# EAGLE schematic Sij2 (EAGLE 7.6.0)
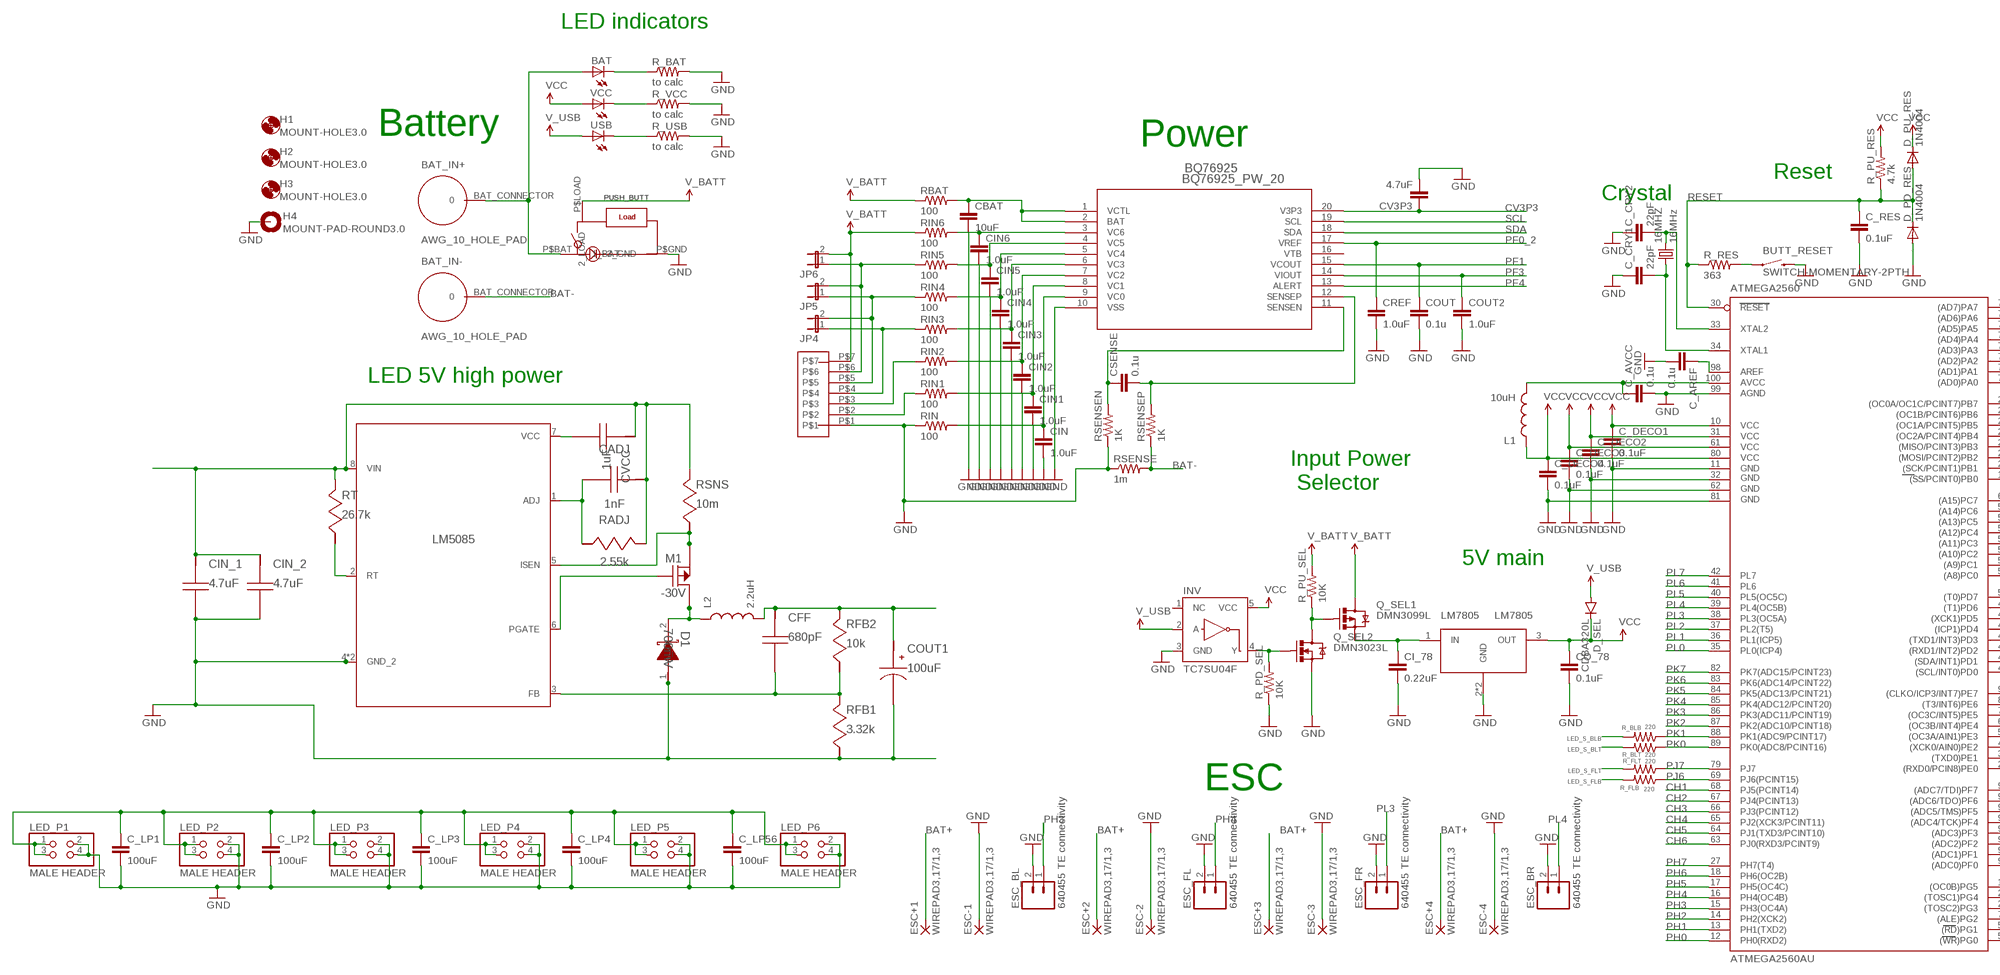
[diagram p0: schematic, sheet 1, part 1 of 2]
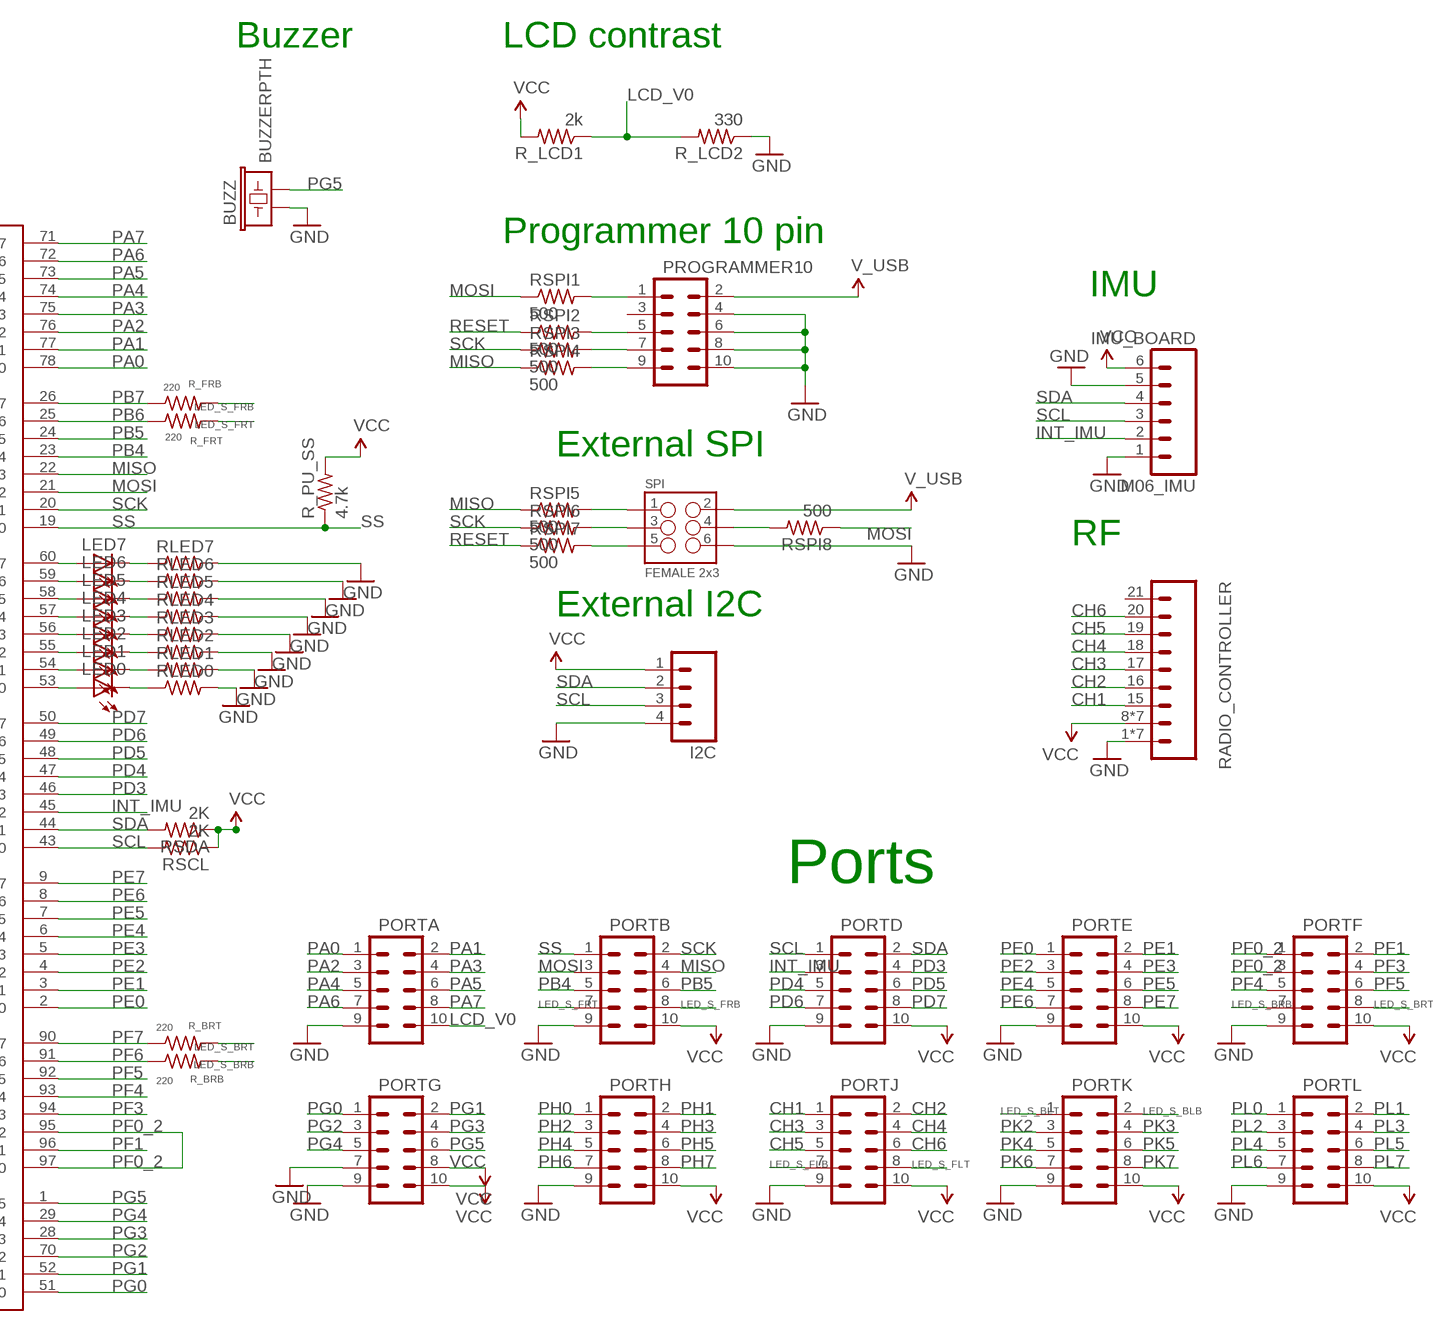
[diagram p1: schematic, sheet 1, part 2 of 2]

## Parts
16MHZ  16MHz  CRYSTALHC49US  [HC49US]
ATMEGA2560  ATMEGA2560AU  [TQFP100]
BAT  LEDCHIPLED_0805  [CHIPLED_0805]
BAT-MONIT  7_PIN_JST-XH  [7_PIN_JST-XH]
BAT_IN+  AWG_10_HOLE_PAD  [AWG10_HOLE_PAD]
BAT_IN-  AWG_10_HOLE_PAD  [AWG10_HOLE_PAD]
BQ76925  BQ76925_PW_20  [PW20]
BUTT_RESET  SWITCH-MOMENTARY-2PTH  [TACTILE-PTH]
BUZZ  BUZZERPTH  [BUZZER-12MM]
C_AREF  0.1u  CAP0603-CAP  [0603-CAP]
C_AVCC  0.1u  CAP0603-CAP  [0603-CAP]
C_CRY1  22pF  22PF-50V-5%(0603)  [0603-CAP]
C_CRY2  22pF  22PF-50V-5%(0603)  [0603-CAP]
C_DECO1  0.1uF  0.1UF-25V-5%(0603)  [0603-CAP]
C_DECO2  0.1uF  0.1UF-25V-5%(0603)  [0603-CAP]
C_DECO3  0.1uF  0.1UF-25V-5%(0603)  [0603-CAP]
C_DECO4  0.1uF  0.1UF-25V-5%(0603)  [0603-CAP]
C_LP1  100uF  CAP1206  [1206]
C_LP2  100uF  CAP1206  [1206]
C_LP3  100uF  CAP1206  [1206]
C_LP4  100uF  CAP1206  [1206]
C_LP56  100uF  CAP1206  [1206]
C_RES  0.1uF  0.1UF-25V-5%(0603)  [0603-CAP]
CADJ  1nF  GRM033R71C102KA01D  [0201]
CBAT  10uF  CAP0805  [0805]
CFF  680pF  GRM188R72E681KW07D  [0603]
CI_78  0.22uF  0.22UF-25V-10%(0603)  [0603-CAP]
CIN  1.0uF  1.0UF-16V-10%(0603)  [0603-CAP]
CIN1  1.0uF  1.0UF-16V-10%(0603)  [0603-CAP]
CIN2  1.0uF  1.0UF-16V-10%(0603)  [0603-CAP]
CIN3  1.0uF  1.0UF-16V-10%(0603)  [0603-CAP]
CIN4  1.0uF  1.0UF-16V-10%(0603)  [0603-CAP]
CIN5  1.0uF  1.0UF-16V-10%(0603)  [0603-CAP]
CIN6  1.0uF  1.0UF-16V-10%(0603)  [0603-CAP]
CIN_1  4.7uF  GRM21BR61E475MA12L  [0805]
CIN_2  4.7uF  GRM21BR61E475MA12L  [0805]
CO_78  0.1uF  0.1UF-25V-5%(0603)  [0603-CAP]
COUT  0.1u  CAP0603-CAP  [0603-CAP]
COUT1  100uF  6TPH100MAEA  [CAPSMT_6_A09]
COUT2  1.0uF  1.0UF-16V-10%(0603)  [0603-CAP]
CREF  1.0uF  1.0UF-16V-10%(0603)  [0603-CAP]
CSENSE  0.1u  CAP0603-CAP  [0603-CAP]
CV3P3  4.7uF  4.7UF-6.3V-10%(0603)0603  [0603-CAP]
CVCC  1uF  GRM188R61C105KA93D  [0603]
D1  700mV  MBRB745PBF  [DDPAK]
D_PD_RES  1N4004  [DO41-10]
D_PU_RES  1N4004  [DO41-10]
D_SEL  CDBA320L  DIODESMA-ALT  [SMA-DIODE_ALT]
ESC+1  WIREPAD3,17/1,3  [3,17/1,3]
ESC+2  WIREPAD3,17/1,3  [3,17/1,3]
ESC+3  WIREPAD3,17/1,3  [3,17/1,3]
ESC+4  WIREPAD3,17/1,3  [3,17/1,3]
ESC-1  WIREPAD3,17/1,3  [3,17/1,3]
ESC-2  WIREPAD3,17/1,3  [3,17/1,3]
ESC-3  WIREPAD3,17/1,3  [3,17/1,3]
ESC-4  WIREPAD3,17/1,3  [3,17/1,3]
ESC_BL  640455 TE connectivity  M02PTH  [1X02]
ESC_BR  640455 TE connectivity  M02PTH  [1X02]
ESC_FL  640455 TE connectivity  M02PTH  [1X02]
ESC_FR  640455 TE connectivity  M02PTH  [1X02]
H1  MOUNT-HOLE3.0  [3,0]
H2  MOUNT-HOLE3.0  [3,0]
H3  MOUNT-HOLE3.0  [3,0]
H4  MOUNT-PAD-ROUND3.0  [3,0-PAD]
I2C  M041X04_NO_SILK  [1X04_NO_SILK]
IMU_BOARD  M06_IMU  [1X06_LONGPADS]
INV  TC7SU04F  INVERTER_SOT23-5  [SOT23-5]
JP4  JUMPER-2PTH  [1X02]
JP5  JUMPER-2PTH  [1X02]
JP6  JUMPER-2PTH  [1X02]
L1  10uH  INDUCTOR0805  [0805]
L2  2.2uH  IND_MGV0605  [MGV0605]
LED0  LEDCHIPLED_0805  [CHIPLED_0805]
LED1  LEDCHIPLED_0805  [CHIPLED_0805]
LED2  LEDCHIPLED_0805  [CHIPLED_0805]
LED3  LEDCHIPLED_0805  [CHIPLED_0805]
LED4  LEDCHIPLED_0805  [CHIPLED_0805]
LED5  LEDCHIPLED_0805  [CHIPLED_0805]
LED6  LEDCHIPLED_0805  [CHIPLED_0805]
LED7  LEDCHIPLED_0805  [CHIPLED_0805]
LED_P1  MALE HEADER  PINHD-2X2  [2X02]
LED_P2  MALE HEADER  PINHD-2X2  [2X02]
LED_P3  MALE HEADER  PINHD-2X2  [2X02]
LED_P4  MALE HEADER  PINHD-2X2  [2X02]
LED_P5  MALE HEADER  PINHD-2X2  [2X02]
LED_P6  MALE HEADER  PINHD-2X2  [2X02]
LM5085  LM5085MY/NOPB  [MUY08A]
LM7805  LM7805  [KTT3]
M1  -30V  SI7149DP  [POWERPAK_SO-8]
PORTA  M05X2PTH  [AVR_ICSP]
PORTB  M05X2PTH  [AVR_ICSP]
PORTD  M05X2PTH  [AVR_ICSP]
PORTE  M05X2PTH  [AVR_ICSP]
PORTF  M05X2PTH  [AVR_ICSP]
PORTG  M05X2PTH  [AVR_ICSP]
PORTH  M05X2PTH  [AVR_ICSP]
PORTJ  M05X2PTH  [AVR_ICSP]
PORTK  M05X2PTH  [AVR_ICSP]
PORTL  M05X2PTH  [AVR_ICSP]
PROGRAMMER10  M05X2PTH  [AVR_ICSP]
PUSH_BUTT  PUSH_BUTTON  [PUSH_BUTTON]
Q_SEL1  DMN3099L  MOSFET-PCHANNEL  [SOT23-3]
Q_SEL2  DMN3023L  MOSFET-NCHANNELAO3404A  [SOT23-3]
R_BAT  to calc  R-US_R0603  [R0603]
R_BLB  220  R-US_R0603  [R0603]
R_BLT  220  R-US_R0603  [R0603]
R_BRB  220  R-US_R0603  [R0603]
R_BRT  220  R-US_R0603  [R0603]
R_FLB  220  R-US_R0603  [R0603]
R_FLT  220  R-US_R0603  [R0603]
R_FRB  220  R-US_R0603  [R0603]
R_FRT  220  R-US_R0603  [R0603]
R_LCD1  2k  R-US_R0603  [R0603]
R_LCD2  330  R-US_R0603  [R0603]
R_PD_SEL  10K  R-US_R0603  [R0603]
R_PU_RES  4.7k  R-US_R0603  [R0603]
R_PU_SEL  10K  R-US_R0603  [R0603]
R_PU_SS  4.7k  R-US_R0603  [R0603]
R_RES  363  R-US_R0603  [R0603]
R_USB  to calc  R-US_R0603  [R0603]
R_VCC  to calc  R-US_R0603  [R0603]
RADIO_CONTROLLER  RF_CONTROL_3X7_CON  [3X07]
RADJ  2.55k  CRCW04022K55FKED  [0603]
RBAT  100  R-US_R0603  [R0603]
RFB1  3.32k  CRCW04023K32FKED  [0603]
RFB2  10k  CRCW040210K0FKED  [0603]
RIN  100  R-US_R0603  [R0603]
RIN1  100  R-US_R0603  [R0603]
RIN2  100  R-US_R0603  [R0603]
RIN3  100  R-US_R0603  [R0603]
RIN4  100  R-US_R0603  [R0603]
RIN5  100  R-US_R0603  [R0603]
RIN6  100  R-US_R0603  [R0603]
RLED0  R-US_R0603  [R0603]
RLED1  R-US_R0603  [R0603]
RLED2  R-US_R0603  [R0603]
RLED3  R-US_R0603  [R0603]
RLED4  R-US_R0603  [R0603]
RLED5  R-US_R0603  [R0603]
RLED6  R-US_R0603  [R0603]
RLED7  R-US_R0603  [R0603]
RSCL  2K  R-US_R0603  [R0603]
RSDA  2K  R-US_R0603  [R0603]
RSENSE  1m  R-US_R1206  [R1206]
RSENSEN  1K  R-US_R0603  [R0603]
RSENSEP  1K  R-US_R0603  [R0603]
RSNS  10m  CSR1206FK10L0  [1206]
RSPI1  500  R-US_R0603  [R0603]
RSPI2  500  R-US_R0603  [R0603]
RSPI3  500  R-US_R0603  [R0603]
RSPI4  500  R-US_R0603  [R0603]
RSPI5  500  R-US_R0603  [R0603]
RSPI6  500  R-US_R0603  [R0603]
RSPI7  500  R-US_R0603  [R0603]
RSPI8  500  R-US_R0603  [R0603]
RT  26.7k  CRCW040226K7FKED  [0603]
SPI  FEMALE 2x3  M03X2FEMALE  [2X3]
USB  LEDCHIPLED_0805  [CHIPLED_0805]
VCC  LEDCHIPLED_0805  [CHIPLED_0805]

## Nets
9_5085: D1.2(K) L2.P$1 M1.5(DRAIN_2) M1.6(DRAIN_2) M1.7(DRAIN_2) M1.8(DRAIN_2) M1.9(DRAIN_2)
ADJ_1085: CADJ.2 LM5085.1(ADJ) RADJ.2
BAT+: BAT.A BAT_IN+.BAT_CONNECTOR ESC+1.1(P) ESC+2.1(P) ESC+3.1(P) ESC+4.1(P) PUSH_BUTT.P$BAT(1_BAT)
BAT-: BAT_IN-.BAT_CONNECTOR RSENSE.2 RSENSEP.1
CH1: ATMEGA2560.68(PJ5(PCINT14)) PORTJ.1 RADIO_CONTROLLER.15
CH2: ATMEGA2560.67(PJ4(PCINT13)) PORTJ.2 RADIO_CONTROLLER.16
CH3: ATMEGA2560.66(PJ3(PCINT12)) PORTJ.3 RADIO_CONTROLLER.17
CH4: ATMEGA2560.65(PJ2(XCK3/PCINT11)) PORTJ.4 RADIO_CONTROLLER.18
CH5: ATMEGA2560.64(PJ1(TXD3/PCINT10)) PORTJ.5 RADIO_CONTROLLER.19
CH6: ATMEGA2560.63(PJ0(RXD3/PCINT9)) PORTJ.6 RADIO_CONTROLLER.20
CV3P3: BQ76925.20(V3P3) CV3P3.1
FB_5085: CFF.2 LM5085.3(FB) RFB1.1 RFB2.2
GND: ATMEGA2560.11(GND) ATMEGA2560.32(GND1) ATMEGA2560.62(GND2) ATMEGA2560.81(GND3) ATMEGA2560.99(AGND) BAT-MONIT.P$1 BQ76925.10(VSS) BUTT_RESET.3 BUTT_RESET.4 BUZZ.+ C_AREF.2 C_AVCC.2 C_CRY1.1 C_CRY2.1 C_DECO1.2 C_DECO2.2 C_DECO3.2 C_DECO4.2 C_LP1.2 C_LP2.2 C_LP3.2 C_LP4.2 C_LP56.2 C_RES.2 CBAT.2 CI_78.2 CIN1.2 CIN2.2 CIN3.2 CIN4.2 CIN5.2 CIN6.2 CIN.2 CIN_1.2 CIN_2.2 CO_78.2 COUT1.2(-) COUT2.2 COUT.2 CREF.2 CV3P3.2 D1.1(A_2) D_PD_RES.A ESC-1.1(P) ESC-2.1(P) ESC-3.1(P) ESC-4.1(P) ESC_BL.2 ESC_BR.2 ESC_FL.2 ESC_FR.2 H4.B3,0(MOUNT) I2C.4 IMU_BOARD.1 IMU_BOARD.5 INV.3(GND) LED_P1.2 LED_P1.4 LED_P2.2 LED_P2.4 LED_P3.2 LED_P3.4 LED_P4.2 LED_P4.4 LED_P5.2 LED_P5.4 LED_P6.2 LED_P6.4 LM5085.4(GND_2) LM5085.9(GND_2) LM7805.2(GND) LM7805.4(GND) PORTA.9 PORTB.9 PORTD.9 PORTE.9 PORTF.9 PORTG.7 PORTG.9 PORTH.9 PORTJ.9 PORTK.9 PORTL.9 PROGRAMMER10.4 PROGRAMMER10.6 PROGRAMMER10.8 PROGRAMMER10.10 PUSH_BUTT.P$GND(3_GND) Q_SEL2.2(S) R_BAT.2 R_LCD2.1 R_PD_SEL.1 R_USB.2 R_VCC.2 RADIO_CONTROLLER.1(GND) RADIO_CONTROLLER.2(GND) RADIO_CONTROLLER.3(GND) RADIO_CONTROLLER.4(GND) RADIO_CONTROLLER.5(GND) RADIO_CONTROLLER.6(GND) RADIO_CONTROLLER.7(GND) RFB1.2 RIN.1 RLED0.2 RLED1.2 RLED2.2 RLED3.2 RLED4.2 RLED5.2 RLED6.2 RLED7.2 RSENSE.1 RSENSEN.1 SPI.6
INT_IMU: ATMEGA2560.45((RXD1/INT2)PD2) IMU_BOARD.2 PORTD.3
ISEN_5085: LM5085.5(ISEN) M1.1(SOURCE_2) M1.2(SOURCE_2) M1.3(SOURCE_2) RSNS.2
LCD_V0: PORTA.10 R_LCD1.1 R_LCD2.2
LED_S_BLB: PORTK.2 R_BLB.2
LED_S_BLT: PORTK.1 R_BLT.2
LED_S_BRB: PORTF.7 R_BRB.2
LED_S_BRT: PORTF.8 R_BRT.2
LED_S_FLB: PORTJ.7 R_FLB.2
LED_S_FLT: PORTJ.8 R_FLT.2
LED_S_FRB: PORTB.8 R_FRB.2
LED_S_FRT: PORTB.7 R_FRT.2
MISO: ATMEGA2560.22((MISO/PCINT3)PB3) PORTB.4 RSPI4.1 RSPI5.1
MOSI: ATMEGA2560.21((MOSI/PCINT2)PB2) PORTB.3 RSPI1.1 RSPI8.1
N$1: PROGRAMMER10.7 RSPI3.2
N$2: PROGRAMMER10.1 RSPI1.2
N$3: PROGRAMMER10.9 RSPI4.2
N$4: CI_78.1 LM7805.1(IN) Q_SEL1.2(S)
N$5: ATMEGA2560.100(AVCC) C_AVCC.1 L1.2
N$6: 16MHZ.1 ATMEGA2560.34(XTAL1) C_CRY1.2
N$7: BQ76925.6(VC3) CIN3.1 RIN3.2
N$8: BQ76925.1(VCTL) BQ76925.2(BAT) CBAT.1 RBAT.2
N$9: BQ76925.7(VC2) CIN2.1 RIN2.2
N$10: BQ76925.8(VC1) CIN1.1 RIN1.2
N$11: BQ76925.9(VC0) CIN.1 RIN.2
N$12: BQ76925.5(VC4) CIN4.1 RIN4.2
N$13: INV.4(Y) Q_SEL2.1(G) R_PD_SEL.2
N$14: ATMEGA2560.60((A15)PC7) LED7.A
N$15: BQ76925.11(SENSEN) CSENSE.1 RSENSEN.2
N$16: BQ76925.12(SENSEP) CSENSE.2 RSENSEP.2
N$17: BQ76925.3(VC6) CIN6.1 RIN6.2
N$18: BQ76925.4(VC5) CIN5.1 RIN5.2
N$19: ATMEGA2560.59((A14)PC6) LED6.A
N$20: ATMEGA2560.58((A13)PC5) LED5.A
N$21: ATMEGA2560.57((A12)PC4) LED4.A
N$22: ATMEGA2560.56((A11)PC3) LED3.A
N$23: BAT-MONIT.P$2 RIN1.1
N$24: RSPI8.2 SPI.4
N$25: ATMEGA2560.55((A10)PC2) LED2.A
N$26: ATMEGA2560.54((A9)PC1) LED1.A
N$27: BAT-MONIT.P$3 RIN2.1
N$28: BAT-MONIT.P$4 JP4.1 RIN3.1
N$29: BAT-MONIT.P$5 JP4.2 JP5.1 RIN4.1
N$30: BAT-MONIT.P$6 JP5.2 JP6.1 RIN5.1
N$31: ATMEGA2560.53((A8)PC0) LED0.A
N$34: BUTT_RESET.1 BUTT_RESET.2 R_RES.2
N$35: R_USB.1 USB.C
N$36: 16MHZ.2 ATMEGA2560.33(XTAL2) C_CRY2.2
N$37: Q_SEL1.1(G) Q_SEL2.3(D) R_PU_SEL.1
N$38: R_VCC.1 VCC.C
N$39: LED7.C RLED7.1
N$40: LED6.C RLED6.1
N$41: LED5.C RLED5.1
N$42: RSPI6.2 SPI.3
N$43: LED4.C RLED4.1
N$44: LED3.C RLED3.1
N$45: LED2.C RLED2.1
N$46: LED1.C RLED1.1
N$47: LED0.C RLED0.1
N$48: BAT.C R_BAT.1
N$55: RSPI5.2 SPI.1
N$61: PROGRAMMER10.5 RSPI2.2
N$62: ATMEGA2560.98(AREF) C_AREF.1
N$64: RSPI7.2 SPI.5
PA0: ATMEGA2560.78((AD0)PA0) PORTA.1
PA1: ATMEGA2560.77((AD1)PA1) PORTA.2
PA2: ATMEGA2560.76((AD2)PA2) PORTA.3
PA3: ATMEGA2560.75((AD3)PA3) PORTA.4
PA4: ATMEGA2560.74((AD4)PA4) PORTA.5
PA5: ATMEGA2560.73((AD5)PA5) PORTA.6
PA6: ATMEGA2560.72((AD6)PA6) PORTA.7
PA7: ATMEGA2560.71((AD7)PA7) PORTA.8
PB4: ATMEGA2560.23((OC2A/PCINT4)PB4) PORTB.5
PB5: ATMEGA2560.24((OC1A/PCINT5)PB5) PORTB.6
PB6: ATMEGA2560.25((OC1B/PCINT6)PB6) R_FRT.1
PB7: ATMEGA2560.26((OC0A/OC1C/PCINT7)PB7) R_FRB.1
PD3: ATMEGA2560.46((TXD1/INT3)PD3) PORTD.4
PD4: ATMEGA2560.47((ICP1)PD4) PORTD.5
PD5: ATMEGA2560.48((XCK1)PD5) PORTD.6
PD6: ATMEGA2560.49((T1)PD6) PORTD.7
PD7: ATMEGA2560.50((T0)PD7) PORTD.8
PE0: ATMEGA2560.2((RXD0/PCIN8)PE0) PORTE.1
PE1: ATMEGA2560.3((TXD0)PE1) PORTE.2
PE2: ATMEGA2560.4((XCK0/AIN0)PE2) PORTE.3
PE3: ATMEGA2560.5((OC3A/AIN1)PE3) PORTE.4
PE4: ATMEGA2560.6((OC3B/INT4)PE4) PORTE.5
PE5: ATMEGA2560.7((OC3C/INT5)PE5) PORTE.6
PE6: ATMEGA2560.8((T3/INT6)PE6) PORTE.7
PE7: ATMEGA2560.9((CLKO/ICP3/INT7)PE7) PORTE.8
PF0_2: ATMEGA2560.95((ADC2)PF2) ATMEGA2560.97((ADC0)PF0) BQ76925.17(VREF) CREF.1 PORTF.1 PORTF.3
PF1: ATMEGA2560.96((ADC1)PF1) BQ76925.15(VCOUT) COUT.1 PORTF.2
PF3: ATMEGA2560.94((ADC3)PF3) BQ76925.14(VIOUT) COUT2.1 PORTF.4
PF4: ATMEGA2560.93((ADC4/TCK)PF4) BQ76925.13(ALERT) PORTF.5
PF5: ATMEGA2560.92((ADC5/TMS)PF5) PORTF.6
PF6: ATMEGA2560.91((ADC6/TDO)PF6) R_BRB.1
PF7: ATMEGA2560.90((ADC7/TDI)PF7) R_BRT.1
PG0: ATMEGA2560.51((WR)PG0) PORTG.1
PG1: ATMEGA2560.52((RD)PG1) PORTG.2
PG2: ATMEGA2560.70((ALE)PG2) PORTG.3
PG3: ATMEGA2560.28((TOSC2)PG3) PORTG.4
PG4: ATMEGA2560.29((TOSC1)PG4) PORTG.5
PG5: ATMEGA2560.1((OC0B)PG5) BUZZ.- PORTG.6
PGATE_5085: LM5085.6(PGATE) M1.4(GATE)
PH0: ATMEGA2560.12(PH0(RXD2)) PORTH.1
PH1: ATMEGA2560.13(PH1(TXD2)) PORTH.2
PH2: ATMEGA2560.14(PH2(XCK2)) PORTH.3
PH3: ATMEGA2560.15(PH3(OC4A)) ESC_BL.1 PORTH.4
PH4: ATMEGA2560.16(PH4(OC4B)) ESC_FL.1 PORTH.5
PH5: ATMEGA2560.17(PH5(OC4C)) PORTH.6
PH6: ATMEGA2560.18(PH6(OC2B)) PORTH.7
PH7: ATMEGA2560.27(PH7(T4)) PORTH.8
PJ6: ATMEGA2560.69(PJ6(PCINT15)) R_FLB.1
PJ7: ATMEGA2560.79(PJ7) R_FLT.1
PK0: ATMEGA2560.89(PK0(ADC8/PCINT16)) R_BLT.1
PK1: ATMEGA2560.88(PK1(ADC9/PCINT17)) R_BLB.1
PK2: ATMEGA2560.87(PK2(ADC10/PCINT18)) PORTK.3
PK3: ATMEGA2560.86(PK3(ADC11/PCINT19)) PORTK.4
PK4: ATMEGA2560.85(PK4(ADC12/PCINT20)) PORTK.5
PK5: ATMEGA2560.84(PK5(ADC13/PCINT21)) PORTK.6
PK6: ATMEGA2560.83(PK6(ADC14/PCINT22)) PORTK.7
PK7: ATMEGA2560.82(PK7(ADC15/PCINT23)) PORTK.8
PL0: ATMEGA2560.35(PL0(ICP4)) PORTL.1
PL1: ATMEGA2560.36(PL1(ICP5)) PORTL.2
PL2: ATMEGA2560.37(PL2(T5)) PORTL.3
PL3: ATMEGA2560.38(PL3(OC5A)) ESC_FR.1 PORTL.4
PL4: ATMEGA2560.39(PL4(OC5B)) ESC_BR.1 PORTL.5
PL5: ATMEGA2560.40(PL5(OC5C)) PORTL.6
PL6: ATMEGA2560.41(PL6) PORTL.7
PL7: ATMEGA2560.42(PL7) PORTL.8
RESET: ATMEGA2560.30(RESET) C_RES.1 D_PD_RES.C D_PU_RES.A R_PU_RES.1 R_RES.1 RSPI2.1 RSPI7.1
RT_5085: LM5085.2(RT) RT.2
SCK: ATMEGA2560.20((SCK/PCINT1)PB1) PORTB.2 RSPI3.1 RSPI6.1
SCL: ATMEGA2560.43((SCL/INT0)PD0) BQ76925.19(SCL) I2C.3 IMU_BOARD.3 PORTD.1 RSCL.2
SDA: ATMEGA2560.44((SDA/INT1)PD1) BQ76925.18(SDA) I2C.2 IMU_BOARD.4 PORTD.2 RSDA.2
SS: ATMEGA2560.19((SS/PCINT0)PB0) PORTB.1 R_PU_SS.1
V_BATT: BAT-MONIT.P$7 CADJ.1 CIN_1.1 CIN_2.1 CVCC.1 JP6.2 LM5085.8(VIN) PUSH_BUTT.P$LOAD(2_LOAD) Q_SEL1.3(D) R_PU_SEL.2 RADJ.1 RBAT.1 RIN6.1 RSNS.1 RT.1
V_USB: D_SEL.A INV.2(A) PROGRAMMER10.2 SPI.2 USB.A
VCC: ATMEGA2560.10(VCC) ATMEGA2560.31(VCC1) ATMEGA2560.61(VCC2) ATMEGA2560.80(VCC3) C_DECO1.1 C_DECO2.1 C_DECO3.1 C_DECO4.1 CO_78.1 D_PU_RES.C D_SEL.C I2C.1 IMU_BOARD.6 INV.5(VCC) L1.1 LM7805.3(OUT) PORTB.10 PORTD.10 PORTE.10 PORTF.10 PORTG.8 PORTG.10 PORTH.10 PORTJ.10 PORTK.10 PORTL.10 R_LCD1.2 R_PU_RES.2 R_PU_SS.2 RADIO_CONTROLLER.8(5V) RADIO_CONTROLLER.9(5V) RADIO_CONTROLLER.10(5V) RADIO_CONTROLLER.11(5V) RADIO_CONTROLLER.12(5V) RADIO_CONTROLLER.13(5V) RADIO_CONTROLLER.14(5V) RSCL.1 RSDA.1 VCC.A
VCC_1085: CVCC.2 LM5085.7(VCC)
VOUT_5085: C_LP1.1 C_LP2.1 C_LP3.1 C_LP4.1 C_LP56.1 CFF.1 COUT1.1(+) L2.P$2 LED_P1.1 LED_P1.3 LED_P2.1 LED_P2.3 LED_P3.1 LED_P3.3 LED_P4.1 LED_P4.3 LED_P5.1 LED_P5.3 LED_P6.1 LED_P6.3 RFB2.1
Unconnected: BQ76925.16(VTB) INV.1(NC) PROGRAMMER10.3 RADIO_CONTROLLER.21

## Notes on the sheet
- LED indicators
- Battery | Power
- Reset
- Buzzer | LCD contrast
- Crystal
- Programmer 10 pin
- IMU
- LED 5V high power
- External SPI
- Input Power
   Selector
- RF
- External I2C
- 5V main
- Ports
- ESC

## Library data of the parts
16MHZ = SparkFun-FreqCtrl:CRYSTAL: Various standard crystals. Proven footprints.; DATASHEET: https://cdn-shop.adafruit.com/product-files/2215/2215datasheet.pdf
ATMEGA2560 = SparkFun-DigitalIC:ATMEGA2560: Atmel 100-pin 8-bit uC 64/128/256 Kbytes FLASH 4 Kbytes EEPROM 8 Kbytes SRAM 86 General Purpose I/O pins 12-channels16-bit PWM 4 x Serial USARTs 16-channels 10-bit A/D; PROD_ID: IC-10040
BAT LED0 LED1-LED7 USB VCC = led:LED: LED OSRAM: - CHIPLED LG R971, LG N971, LY N971, LG Q971, LY Q971, LO R971, LY R971 LH N974, LH R974 LS Q976, LO Q976, LY Q976 LO Q996 - Hyper CHIPLED LW Q18S LB Q993, LB Q99A, LB R99A - SideLED LS A670, LO A670, LY A670, LG A670, LP A670 LB A673, LV A673, LT A673, LW A673 LH A674 LY A675 LS A676, LA A676, LO A676, LY A676, LW A676 LS A679, LY A679, LG A679 - Hyper Micro SIDELED® LS Y876, LA Y876, LO Y876, LY Y876 LT Y87S - SmartLED LW L88C, LW L88S LB L89C, LB L89S, LG L890 LS L89K, LO L89K, LY L89K LS L896, LA L896, LO L896, LY L896 - TOPLED LS T670, LO T670, LY T670, LG T670, LP T670 LSG T670, LSP T670, LSY T670, LOP T670, LYG T670 LG T671, LOG T671, LSG T671 LB T673, LV T673, LT T673, LW T673 LH T674 LS T676, LA T676, LO T676, LY T676, LB T676, LH T676, LSB T676, LW T676 LB T67C, LV T67C, LT T67C, LS T67K, LO T67K, LY T67K, LW E67C LS E67B, LA E67B, LO E67B, LY E67B, LB E67C, LV E67C, LT E67C LW T67C LS T679, LY T679, LG T679 LS T770, LO T770, LY T770, LG T770, LP T770 LB T773, LV T773, LT T773, LW T773 LH T774 LS E675, LA E675, LY E675, LS T675 LS T776, LA T776, LO T776, LY T776, LB T776 LHGB T686 LT T68C, LB T68C - Hyper Mini TOPLED® LB M676 - Mini TOPLED Santana® LG M470 LS M47K, LO M47K, LY M47K Source: http://www.osram.convergy.de LUXEON: - LUMILED® LXK2-PW12-R00, LXK2-PW12-S00, LXK2-PW14-U00, LXK2-PW14-V00 LXK2-PM12-R00, LXK2-PM12-S00, LXK2-PM14-U00 LXK2-PE12-Q00, LXK2-PE12-R00, LXK2-PE12-S00, LXK2-PE14-T00, LXK2-PE14-U00 LXK2-PB12-K00, LXK2-PB12-L00, LXK2-PB12-M00, LXK2-PB14-N00, LXK2-PB14-P00, LXK2-PB14-Q00 LXK2-PR12-L00, LXK2-PR12-M00, LXK2-PR14-Q00, LXK2-PR14-R00 LXK2-PD12-Q00, LXK2-PD12-R00, LXK2-PD12-S00 LXK2-PH12-R00, LXK2-PH12-S00 LXK2-PL12-P00, LXK2-PL12-Q00, LXK2-PL12-R00 Source: www.luxeon.com KINGBRIGHT: KA-3528ASYC Source: www.kingbright.com
BAT-MONIT = JST-XH_HEADERS:7_PIN_JST-XH
BAT_IN+ BAT_IN- = custom_parts:AWG_10_HOLE_PAD; AWG_RATING: 12
BQ76925 = TI:BQ76925_PW_20; DATASHEETURL: http://www.ti.com/lit/gpn/BQ76925; DESCRIPTION: Analog Front End for 3 to 6 Series Lithium-Ion Cells; FAMILY_NAME: LITHIUM ION PROTECTION; GENERIC_PART_NUMBER: BQ76925; INDUSTRY_STD_PKG_TYPE: TSSOP; MANUFACTURER: Texas Instruments; MANUFACTURER_PART_NUMBER: bq76925_pw_20; PACKAGE_DESIGNATOR: PW; PIN_COUNT: 20; VENDOR: Texas Instruments
BUTT_RESET = SparkFun-Electromechanical:SWITCH-MOMENTARY-2: Various NO switches- pushbuttons, reed, etc; PROD_ID: SWCH-08441
BUZZ = SparkFun-Electromechanical:BUZZER: Buzzer 12mm Spark Fun Electronics SKU : Comp-Buzzer
C_AREF C_AVCC CBAT COUT = SparkFun-Capacitors:CAP: Capacitor Standard 0603 ceramic capacitor, and 0.1" leaded capacitor.
C_CRY1 C_CRY2 = SparkFun-Capacitors:22PF-50V-5%(0603): CAP-07876; PROD_ID: CAP-07876
C_DECO1-C_DECO4 C_RES CO_78 = SparkFun-Capacitors:0.1UF-25V-5%(0603): CAP-08604; PROD_ID: CAP-08604
C_LP1-C_LP4 C_LP56 = SparkFun-Capacitors:CAP: Capacitor Standard 0603 ceramic capacitor, and 0.1" leaded capacitor.; DATASHEET: http://www.digikey.ca/product-detail/en/murata-electronics-north-america/GRM31CD80J107ME39L/490-10525-1-ND/5026461
CADJ = LM5085:GRM033R71C102KA01D; CAP: 1.0E-9; ESR: 0.0; IRMS: 0.0; MANUFACTURER_NAME: MuRata; MANUFACTURER_PART_NUMBER: GRM033R71C102KA01D; VDC: 16.0; VENDOR: MuRata
CFF = LM5085:GRM188R72E681KW07D; CAP: 6.8E-10; ESR: 0.0; IRMS: 0.0; MANUFACTURER_NAME: MuRata; MANUFACTURER_PART_NUMBER: GRM188R72E681KW07D; VDC: 250.0; VENDOR: MuRata
CI_78 = SparkFun-Capacitors:0.22UF-25V-10%(0603): CAP-07822; PROD_ID: CAP-07822
CIN CIN1-CIN6 COUT2 CREF = SparkFun-Capacitors:1.0UF-16V-10%(0603): CAP-00868; PROD_ID: CAP-00868
CIN_1 CIN_2 = LM5085:GRM21BR61E475MA12L; CAP: 4.7E-6; DATASHEETURL: http://www.murata.com/products/catalog/pdf/c02e.pdf; ESR: 0.0020; IRMS: 7.29; MANUFACTURER_NAME: MuRata; MANUFACTURER_PART_NUMBER: GRM21BR61E475MA12L; VDC: 25.0; VENDOR: MuRata
COUT1 = LM5085:6TPH100MAEA; CAP: 1.0E-4; DATASHEETURL: http://industrial.panasonic.com/www%2Ddata/pdf/AAA8000/AAA8000CE2.pdf; ESR: 0.1; IRMS: 0.67; MANUFACTURER_NAME: Panasonic; MANUFACTURER_PART_NUMBER: 6TPH100MAEA; VDC: 6.3; VENDOR: Panasonic
CSENSE = SparkFun-Passives:CAP: Capacitor Standard 0603 ceramic capacitor, and 0.1" leaded capacitor.
CV3P3 = SparkFun-Capacitors:4.7UF-6.3V-10%(0603): CAP-08280; PROD_ID: CAP-08280
CVCC = LM5085:GRM188R61C105KA93D; CAP: 1.0E-6; ESR: 0.0; IRMS: 0.0; MANUFACTURER_NAME: MuRata; MANUFACTURER_PART_NUMBER: GRM188R61C105KA93D; VDC: 16.0; VENDOR: MuRata
D1 = LM5085:MBRB745PBF; DATASHEETURL: http://www.vishay.com/docs/88680/88680.pdf; IO: 7.5; MANUFACTURER_NAME: Vishay-Semiconductor; MANUFACTURER_PART_NUMBER: MBRB745PBF; VENDOR: Vishay-Semiconductor; VFATIO: 0.7; VRRM: 45.0
D_PD_RES D_PU_RES = diode:1N4004: DIODE general purpose rectifier, 1 A; DATASHEET: http://www.diodes.com/_files/datasheets/ds28002.pdf; DIGIKEY: http://www.digikey.ca/product-detail/en/diodes-incorporated/1N4004-T/1N4004DICT-ND/160593
D_SEL = SparkFun-DiscreteSemi:DIODE: Diode These are standard reverse protection diodes and small signal diodes. SMA package can handle up to about 1A. SOD-323 can handle about 200mA. What the SOD-323 package when ordering, there are some mfgs out there that are 5-pin packages.; DATASHEET: http://www.comchiptech.com/cms/UserFiles/CDBA320L-G%20Thru042439.%20CDBA340L-G%20RevA.pdf
ESC+1-ESC+4 ESC-1-ESC-4 = wirepad:WIREPAD: Wire PAD connect wire on PCB; AWG_RATING: 18
ESC_BL ESC_BR ESC_FL ESC_FR = SparkFun-Connectors:M02: Standard 2-pin 0.1" header. Use with - straight break away headers ( PRT-00116) - right angle break away headers (PRT-00553) - swiss pins (PRT-00743) - machine pins (PRT-00117) - female headers (PRT-00115) Molex polarized connector foot print use with: PRT-08233 with associated crimp pins and housings. 2.54_SCREWTERM for use with PRT-10571. 3.5mm Screw Terminal footprints for PRT-08084 5mm Screw Terminal footprints for use with PRT-08432
H1-H3 = holes:MOUNT-HOLE: MOUNTING HOLE with drill center marker
H4 = holes:MOUNT-PAD-ROUND: MOUNTING PAD, round
I2C = SparkFun-Connectors:M04: Header 4 Standard 4-pin 0.1" header. Use with straight break away headers (SKU : PRT-00116), right angle break away headers (PRT-00553), swiss pins (PRT-00743), machine pins (PRT-00117), and female headers (PRT-00115). Molex polarized connector foot print use with SKU : PRT-08231 with associated crimp pins and housings. 1MM SMD Version SKU: PRT-10208; PROD_ID: CONN-09696
IMU_BOARD = custom_parts:M06_IMU
INV = SparkFun-DigitalIC:INVERTER: Single inverter, SOT23-5; DATASHEET: http://www.digikey.com/product-detail/en/toshiba-semiconductor-and-storage/TC7SU04F,LF/TC7SU04FLFCT-ND/870667; NOTE: RETIRED; PROD_ID: 8211
JP4-JP6 = SparkFun-Retired:JUMPER-2: Jumper Basic 0.1" spaced jumper. Use with breakaway headers.
L1 = SparkFun-Passives:INDUCTOR: Inductors Basic Inductor/Choke - 0603 and 1206. Footprints are not proven and vary greatly between part numbers. INDUCTOR POWER 3.3UH 4.0A SMD 0.197" L x 0.197" W x 0.177" H (5.00mm x 5.00mm x 4.50mm); DATASHEET: http://www.yuden.co.jp/productdata/catalog/en/wound01_e.pdf; DIGIKEY: http://www.digikey.ca/product-detail/en/taiyo-yuden/LBR2012T100K/587-2045-1-ND/1788992
L2 = custom_parts:IND_MGV0605; DATASHEET: http://cdn.lairdtech.com/home/brandworld/files/SIP-DS-MGV0605%200513.pdf; DIGIKEY: http://www.digikey.ca/product-detail/en/laird-signal-integrity-products/MGV06052R2M-10/240-2911-1-ND/5269966
LED_P1-LED_P6 = pinhead:PINHD-2X2: PIN HEADER
LM5085 = LM5085:LM5085MY/NOPB; DATASHEETURL: http://www.ti.com/product/lm5085; FREQUENCY: 2000000.0; IMAX: 12.0; MANUFACTURER_NAME: Texas Instruments; MANUFACTURER_PART_NUMBER: LM5085MY/NOPB; MKTG_PACKAGE: NA; NSID: LM5085MM/NOPB; PACKAGE: NA; VENDOR: Texas Instruments
LM7805 = TI:LM7805: LDO linear 5V regulator; DATASHEET: pdf
M1 = LM5085:SI7149DP; DATASHEETURL: http://www.vishay.com/docs/68934/si7149dp.pdf; IDSMAX: -23.7; MANUFACTURER_NAME: Vishay-Siliconix; MANUFACTURER_PART_NUMBER: Si7149DP; QGTYP: 77.0; QUANTITY: 1; RDSON45: 0.0094; VDSMAX: -30.0; VENDOR: Vishay-Siliconix
PORTA PORTB PORTD PORTE PORTF PORTG PORTH PORTJ PORTK PORTL PROGRAMMER10 = SparkFun-Connectors:M05X2: Header 5x2 Standard 10-pin dual row 0.1" header. Commonly used with AVR-ISP. Use with Spark Fun Electronics SKU: PRT-00778
PUSH_BUTT = custom_parts:PUSH_BUTTON; AWG_RATING: 16; DATASHEET: http://media.digikey.com/pdf/Data%20Sheets/CW%20Industries%20PDFs/GPB553A2L01Bx_Dwg.pdf; DIGIKEY: http://www.digikey.ca/product-detail/en/cw-industries/GPB553A2L01BR/CWI267-ND/3193563
Q_SEL1 = SparkFun-DiscreteSemi:MOSFET-PCHANNEL: Generic PMOSFET IRLML2244 - TRANS-11153 (SOT-23 -20V -4.3A) (1.Gate 2.Source 3.Drain) FQP27P06 - COM-10349 <http://www.sparkfun.com/products/10349> (TO-220 -60V -27A) (1.Gate 2.Source 3.Drain); DATASHEET: http://www.diodes.com/_files/datasheets/DMP3099L.pdf; PROD_ID: TRANS-08285
Q_SEL2 = SparkFun-DiscreteSemi:MOSFET-NCHANNEL: Common NMOSFET Parts MFG P/N Store ID Prod ID FDD8780 TRANS-09984 SI7820DN TRANS-11055 FDS6630A IC-08089 2N7002PW TRANS-11151 FQP30N06L COM-10213 TRANS-10060 BSS123LT1G TRANS-08345 BSS138 TRANS-00830 BS170 2N7000; DATASHEET: http://www.diodes.com/_files/datasheets/DMN3023L.pdf; PROD_ID: TRAN-12988
R_BAT R_BLB R_BLT R_BRB R_BRT R_FLB R_FLT R_FRB R_FRT R_LCD1 R_LCD2 R_PD_SEL R_PU_RES R_PU_SEL R_PU_SS R_RES R_USB R_VCC RBAT RIN RIN1-RIN6 RLED0 RLED1-RLED7 RSCL RSDA RSENSE RSENSEN RSENSEP RSPI1-RSPI8 = resistor:R-US_: RESISTOR, American symbol
RADIO_CONTROLLER = custom_parts:RF_CONTROL_3X7_CON; DIGIKEY: http://www.digikey.ca/product-search/en?mpart=S7B-XH-A%28LF%29%28SN%29&vendor=455
RADJ = LM5085:CRCW04022K55FKED
RFB1 = LM5085:CRCW04023K32FKED
RFB2 = LM5085:CRCW040210K0FKED
RSNS = LM5085:CSR1206FK10L0; MANUFACTURER_NAME: Stackpole Electronics Inc; MANUFACTURER_PART_NUMBER: CSR1206FK10L0; POWER: 0.5; RESISTANCE: 0.01; TOLERANCE: 1.0; VENDOR: Stackpole Electronics Inc
RT = LM5085:CRCW040226K7FKED
SPI = SparkFun-Connectors:M03X2: 2x3 .1" header. Shrouded, with keying- CONN-10681 SMT- CONN-11415 Pogo pins- HW-11044; PROD_ID: CONN-11566